# EAGLE design 23256_ROM-el_v1 (EAGLE 7.7.0)
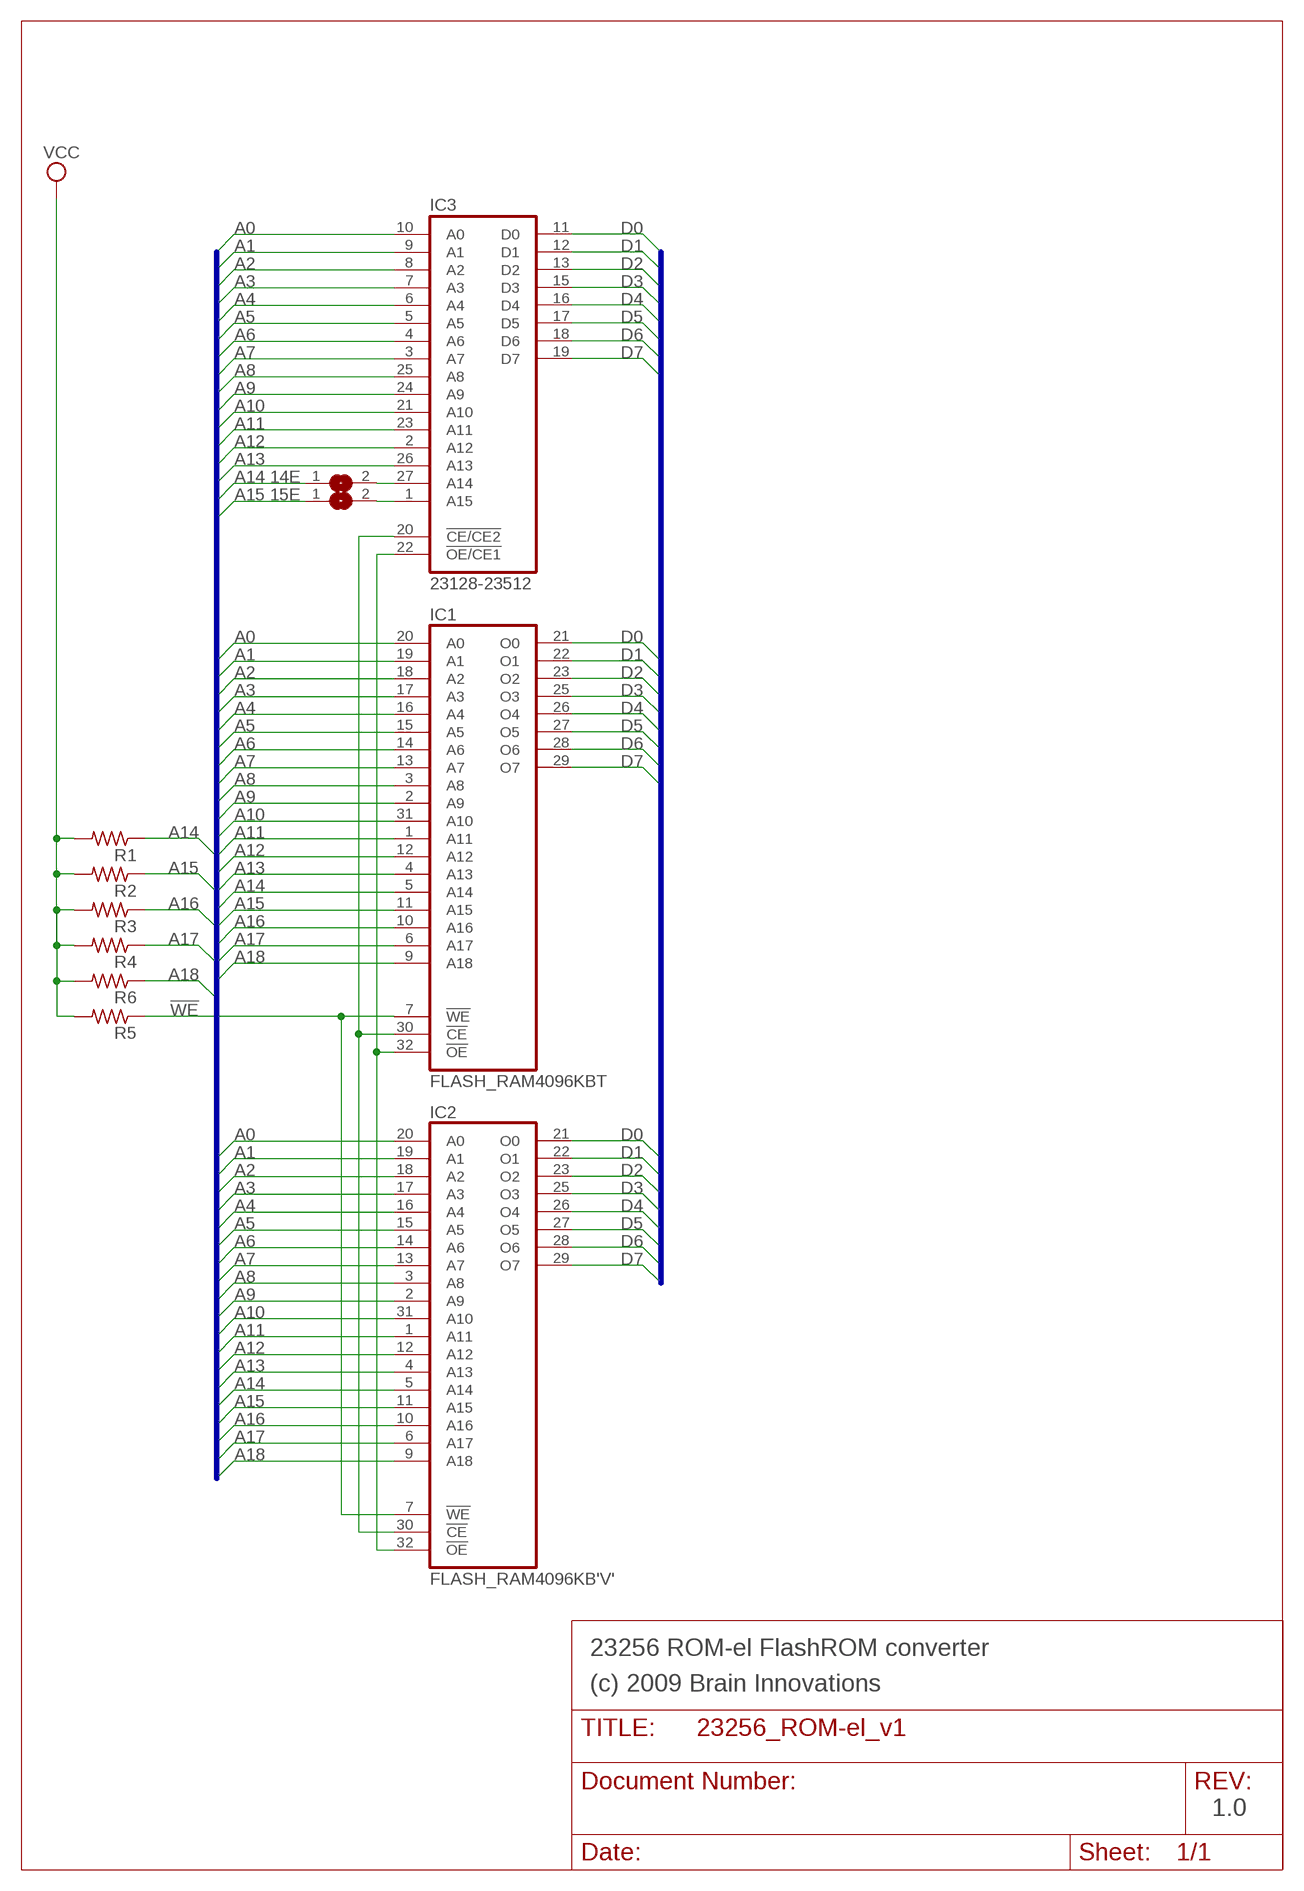
[diagram p0: schematic, sheet 1]

## Parts
14E  SJ  [SJ]
15E  15E  SJ  [SJ]
IC1  FLASH_RAM4096KBT  FLASH_RAM4096KB'T'  [TSOP32]
IC2  FLASH_RAM4096KB'V'  [VSOP32]
IC3  23128-23512  23512-RP  [DIL28-ROUNDPAD]
R1  R-US_R0805  [R0805]
R2  R-US_R0805  [R0805]
R3  R-US_R0805  [R0805]
R4  R-US_R0805  [R0805]
R5  R-US_R0805  [R0805]
R6  R-US_R0805  [R0805]

## Nets
!WE: IC1.7(!WE) IC2.7(!WE) R5.1
A0: IC1.20(A0) IC2.20(A0) IC3.10(A0)
A1: IC1.19(A1) IC2.19(A1) IC3.9(A1)
A2: IC1.18(A2) IC2.18(A2) IC3.8(A2)
A3: IC1.17(A3) IC2.17(A3) IC3.7(A3)
A4: IC1.16(A4) IC2.16(A4) IC3.6(A4)
A5: IC1.15(A5) IC2.15(A5) IC3.5(A5)
A6: IC1.14(A6) IC2.14(A6) IC3.4(A6)
A7: IC1.13(A7) IC2.13(A7) IC3.3(A7)
A8: IC1.3(A8) IC2.3(A8) IC3.25(A8)
A9: IC1.2(A9) IC2.2(A9) IC3.24(A9)
A10: IC1.31(A10) IC2.31(A10) IC3.21(A10)
A11: IC1.1(A11) IC2.1(A11) IC3.23(A11)
A12: IC1.12(A12) IC2.12(A12) IC3.2(A12)
A13: IC1.4(A13) IC2.4(A13) IC3.26(A13)
A14: 14E.1 IC1.5(A14) IC2.5(A14) R1.1
A15: 15E.1 IC1.11(A15) IC2.11(A15) R2.1
A16: IC1.10(A16) IC2.10(A16) R3.1
A17: IC1.6(A17) IC2.6(A17) R4.1
A18: IC1.9(A18) IC2.9(A18) R6.1
D0: IC1.21(O0) IC2.21(O0) IC3.11(D0)
D1: IC1.22(O1) IC2.22(O1) IC3.12(D1)
D2: IC1.23(O2) IC2.23(O2) IC3.13(D2)
D3: IC1.25(O3) IC2.25(O3) IC3.15(D3)
D4: IC1.26(O4) IC2.26(O4) IC3.16(D4)
D5: IC1.27(O5) IC2.27(O5) IC3.17(D5)
D6: IC1.28(O6) IC2.28(O6) IC3.18(D6)
D7: IC1.29(O7) IC2.29(O7) IC3.19(D7)
N$1: IC1.32(!OE) IC2.32(!OE) IC3.22(!OE/CE1)
N$2: IC1.30(!CE) IC2.30(!CE) IC3.20(!CE/CE2)
N$3: 14E.2 IC3.27(A14)
N$4: 15E.2 IC3.1(A15)
VCC: R1.2 R2.2 R3.2 R4.2 R5.2 R6.2

## Buses
A[0..18]
D[0..7]

## Notes on the sheet
- 23256 ROM-el FlashROM converter
- (c) 2009 Brain Innovations
- 1.0

## Power pins joined to a net without a drawn wire
GND: IC1.24(GND) IC2.24(GND) IC3.14(GND)
VCC: IC1.8(VCC) IC2.8(VCC) IC3.28(VCC)

## Library data of the parts
14E 15E = jumper:SJ: SMD solder JUMPER
IC1 IC2 = memory-jedec:FLASH_RAM4096KB
IC3 = commodore:23512: MEMORY
R1-R6 = resistor:R-US_: RESISTOR, American symbol

## Board
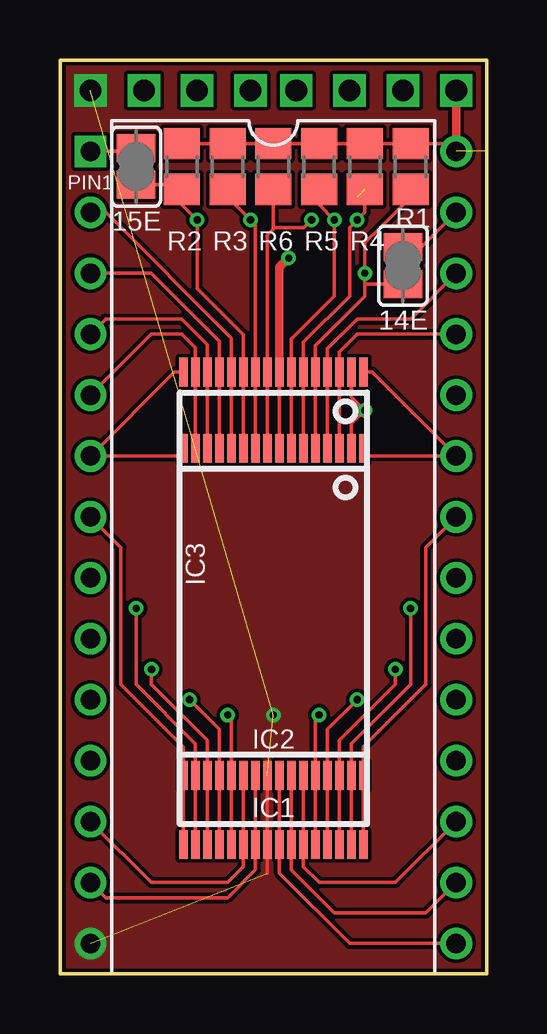
[diagram p1: board, top side]
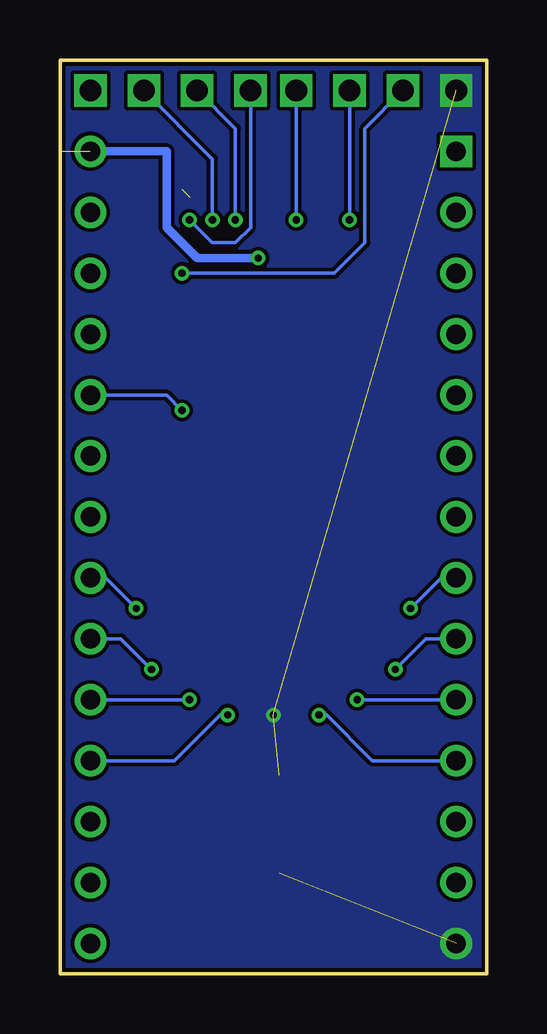
[diagram p2: board, bottom side, seen from below]

Size 17.78 x 38.1 mm. Coordinates in mm from the lower left corner, seen from the top.
Outline: 0,0 17.78,0 17.78,38.1 0,38.1 0,0
Copper layers (1*16): Top 0.035mm / dielectric 1.5mm / Bottom 0.035mm
Design rules "hackvana": minimum track width 6mil, minimum drill 0.3mm, track to track 6mil, track to pad 6mil, pad to pad 6mil, via to via 6mil, smd to smd 0mil, copper to edge 6mil, drill to drill 6mil, minimum pad ring 10mil, minimum via ring 6mil, stop-mask expansion 2mil, vias tented up to drill 100mil, thermal gap 10mil

### Footprints (pad centres in the part's own frame; a part is rotated, then mirrored left to right if it is on the bottom)
SJ = smd 1.168 x 1.6: 1 -0.762,0; 2 0.762,0
TSOP32 = smd 1.2 x 0.36: 1 -9.85,3.75; 2 -9.85,3.25; 3 -9.85,2.75; 4 -9.85,2.25; 5 -9.85,1.75; 6 -9.85,1.25; 7 -9.85,0.75; 8 -9.85,0.25; 9 -9.85,-0.25; 10 -9.85,-0.75; 11 -9.85,-1.25; 12 -9.85,-1.75; 13 -9.85,-2.25; 14 -9.85,-2.75; 15 -9.85,-3.25; 16 -9.85,-3.75; 17 9.85,-3.75; 18 9.85,-3.25; 19 9.85,-2.75; 20 9.85,-2.25; 21 9.85,-1.75; 22 9.85,-1.25; 23 9.85,-0.75; 24 9.85,-0.25; 25 9.85,0.25; 26 9.85,0.75; 27 9.85,1.25; 28 9.85,1.75; 29 9.85,2.25; 30 9.85,2.75; 31 9.85,3.25; 32 9.85,3.75
VSOP32 = smd 1.2 x 0.36: 1 -7.31,3.75; 2 -7.31,3.25; 3 -7.31,2.75; 4 -7.31,2.25; 5 -7.31,1.75; 6 -7.31,1.25; 7 -7.31,0.75; 8 -7.31,0.25; 9 -7.31,-0.25; 10 -7.31,-0.75; 11 -7.31,-1.25; 12 -7.31,-1.75; 13 -7.31,-2.25; 14 -7.31,-2.75; 15 -7.31,-3.25; 16 -7.31,-3.75; 17 6.322,-3.75; 18 6.322,-3.25; 19 6.322,-2.75; 20 6.322,-2.25; 21 6.322,-1.75; 22 6.322,-1.25; 23 6.322,-0.75; 24 6.322,-0.25; 25 6.322,0.25; 26 6.322,0.75; 27 6.322,1.25; 28 6.322,1.75; 29 6.322,2.25; 30 6.322,2.75; 31 6.322,3.25; 32 6.322,3.75
DIL28-ROUNDPAD = drill 0.813 square: 1 -16.51,-7.62 | drill 0.813: 2 -13.97,-7.62; 3 -11.43,-7.62; 4 -8.89,-7.62; 5 -6.35,-7.62; 6 -3.81,-7.62; 7 -1.27,-7.62; 8 1.27,-7.62; 9 3.81,-7.62; 10 6.35,-7.62; 11 8.89,-7.62; 12 11.43,-7.62; 13 13.97,-7.62; 14 16.51,-7.62; 15 16.51,7.62; 16 13.97,7.62; 17 11.43,7.62; 18 8.89,7.62; 19 6.35,7.62; 20 3.81,7.62; 21 1.27,7.62; 22 -1.27,7.62; 23 -3.81,7.62; 24 -6.35,7.62; 25 -8.89,7.62; 26 -11.43,7.62; 27 -13.97,7.62; 28 -16.51,7.62
R0805 = smd 1.3 x 1.5: 1 -0.95,0; 2 0.95,0

### Placement (x,y rotation side)
14E  14.29,29.53 90 top
15E  3.17,33.66 90 top
IC1  8.89,15.24 270 top
IC2  8.89,14.61 270 top
IC3  8.89,17.78 270 top
R1  14.61,33.66 90 top
R2  5.08,33.66 90 top
R3  6.99,33.66 90 top
R4  12.7,33.66 90 top
R5  10.79,33.66 90 top
R6  8.89,33.66 90 top

### Tracks (layer width: path | path; a pad name or v marks a point on that pad's centre or on a via)
!WE  (via drill 0.3, 0.9)
  Top 0.152: R5.1 10.79,32.07 v11.43,31.43 11.43,28.26 9.64,26.47 IC1.7 IC2.7
  Bottom 0.152: v14.29,36.83 11.43,33.97 v11.43,31.43
A0  (via drill 0.3)
  Top 0.152: v5.4,11.43 6.64,10.19 IC1.20 IC2.20
  Bottom 0.152: IC3.10 v5.4,11.43
A1  (via drill 0.3)
  Top 0.152: v3.81,12.7 3.81,12.06 6.14,9.73 IC2.19 IC1.19
  Bottom 0.152: IC3.9 2.54,13.97 v3.81,12.7
A2  (via drill 0.3)
  Top 0.152: v3.17,15.24 3.17,12.06 5.64,9.6 IC2.18 IC1.18
  Bottom 0.152: IC3.8 1.91,16.51 v3.17,15.24
A3
  Top 0.152: IC3.7 2.54,17.78 2.54,12.06 5.14,9.46 IC1.17 IC2.17
A4
  Top 0.152: IC1.16 4.77,25.09 IC3.6 | IC3.6 | IC3.6 5.08,21.59 5.08,21.91 IC2.16
A5
  Top 0.152: IC3.5 3.81,26.67 5.08,26.67 5.64,26.11 IC1.15 IC2.15
A6
  Top 0.152: IC3.4 1.91,27.3 5.08,27.3 6.14,26.25 IC1.14 IC2.14
A7
  Top 0.152: IC3.3 3.81,29.21 6.64,26.38 IC1.13 IC2.13
A8
  Top 0.152: IC3.25 12.38,26.67 11.64,25.93 IC1.3 IC2.3
A9  (via drill 0.3)
  Top 0.152: IC1.2 12.14,24.05 v12.7,23.5 12.14,22.93 IC2.2
  Bottom 0.152: v12.7,23.5 13.34,24.13 IC3.24
A10  (via drill 0.3)
  Top 0.152: v14.61,15.24 14.61,12.06 12.14,9.6 IC1.31 IC2.31
  Bottom 0.152: IC3.21 15.88,16.51 v14.61,15.24
A11
  Top 0.152: IC2.1 12.64,21.6 IC3.23 13.01,25.09 IC1.1
A12
  Top 0.152: IC3.2 1.91,31.75 7.14,26.52 IC1.12 IC2.12
A13
  Top 0.152: IC3.26 14.61,27.3 12.38,27.3 11.14,26.06 IC1.4 IC2.4
A14  (via drill 0.3, 0.9)
  Top 0.152: 12.7,28.77 v12.7,29.21 12.7,30.48 13.34,31.11 14.61,32.38 R1.1 | 12.7,28.77 12.7,28.26 10.64,26.2 IC1.5 IC2.5 | 12.7,28.77 14E.1
  Bottom 0.152: v3.49,36.83 5.08,35.24 5.08,30.48 6.35,29.21 v12.7,29.21
A15  (via drill 0.3, 0.9)
  Top 0.152: IC2.11 IC1.11 7.64,26.65 5.71,28.57 v5.71,31.43 5.08,32.07 R2.1 4.89,32.89 15E.1
  Bottom 0.152: v5.71,31.43 v5.71,36.83
A16  (via drill 0.3, 0.9)
  Top 0.152: R3.1 6.99,32.38 v7.94,31.43 8.14,31.23 IC1.10 IC2.10
  Bottom 0.152: v7.94,31.43 v7.94,36.83
A17  (via drill 0.3, 0.9)  (1 unrouted)
  Top 0.152: IC2.6 IC1.6 10.14,26.33 12.06,28.26 12.06,31.11 v12.38,31.43 12.7,31.75 R4.1 | 12.38,32.38 12.38,32.39
  Bottom 0.152: v9.84,36.83 9.84,31.11 10.48,30.48 11.43,30.48 v12.38,31.43
A18  (via drill 0.3, 0.9)
  Top 0.152: IC2.9 IC1.9 8.64,30.8 | v10.48,31.43 10.16,31.11 8.96,31.11 8.64,30.8 | R6.1 8.89,31.05 8.64,30.8
  Bottom 0.152: v12.06,36.83 10.48,35.24 v10.48,31.43
D0  (via drill 0.3)
  Top 0.152: v6.99,10.79 7.14,10.64 IC2.21 IC1.21
  Bottom 0.152: v6.99,10.79 6.67,10.79 4.76,8.89 IC3.11
D1
  Top 0.152: IC3.12 3.81,3.81 6.99,3.81 7.64,4.46 IC1.22 IC2.22
D2
  Top 0.152: IC3.13 1.91,3.17 6.99,3.17 8.14,4.33 IC1.23 IC2.23
D3
  Top 0.152: IC3.15 12.06,1.27 9.14,4.2 IC1.25 IC2.25
D4
  Top 0.152: IC3.16 15.24,2.54 11.43,2.54 9.64,4.33 IC1.26 IC2.26
D5
  Top 0.152: IC3.17 13.97,3.81 10.79,3.81 10.14,4.46 IC1.27 IC2.27
D6  (via drill 0.3)
  Top 0.152: v10.79,10.79 10.64,10.64 IC1.28 IC2.28
  Bottom 0.152: IC3.18 13.02,8.89 11.11,10.79 v10.79,10.79
D7  (via drill 0.3)
  Top 0.152: v12.38,11.43 11.14,10.19 IC1.29 IC2.29
  Bottom 0.152: IC3.19 v12.38,11.43
GND  (via drill 0.3, 0.9)  (3 unrouted)
  Top 0.152: 8.64,4.2 IC1.24 IC2.24
  other vias: 8.89,10.79 1.27,36.83
  pour Top (no thermals): 0,38.1 17.78,38.1 17.78,0 0,0
  pour Bottom (no thermals): 0,38.1 17.78,38.1 17.78,0 0,0
N$1
  Top 0.152: IC3.22 15.24,17.78 15.24,12.06 12.64,9.46 IC1.32 IC2.32
N$2  (via drill 0.3)
  Top 0.152: v13.97,12.7 13.97,12.06 11.64,9.73 IC1.30 IC2.30
  Bottom 0.152: IC3.20 15.24,13.97 v13.97,12.7
N$3
  Top 0.152: IC3.27 15.05,30.29 14E.2
N$4
  Top 0.152: IC3.1 3.05,34.29 15E.2
VCC  (via drill 0.3, 0.9)  (1 unrouted)
  Top 0.152: R1.2 14.61,34.29 | IC2.8 IC1.8 | R1.2 R4.2 R5.2 R6.2 R3.2 R2.2 | R1.2 16.51,34.6 16.51,34.92
  Top 0.356: IC3.28 16.51,34.92 v16.51,36.83 | IC1.8 9.14,29.46 v9.53,29.84
  Bottom 0.152: IC3.28 15.39,34.29
  Bottom 0.356: v9.53,29.84 12.06,29.84 13.34,31.11 13.34,34.29 IC3.28

### Text on the board
tNames: PIN1
tValues: - | 14 | 15 | 16 | 17 | 18 | !WE | + | ROM-el | www.go4retro.com | (c)2009-11 RETRO Innovations